# EAGLE design PIC18F2550 (EAGLE 5.11)
LEFT: DCIN; LICENSE: CC-0; PROJECT: PIC18F2550 BB; RIGHT: USB
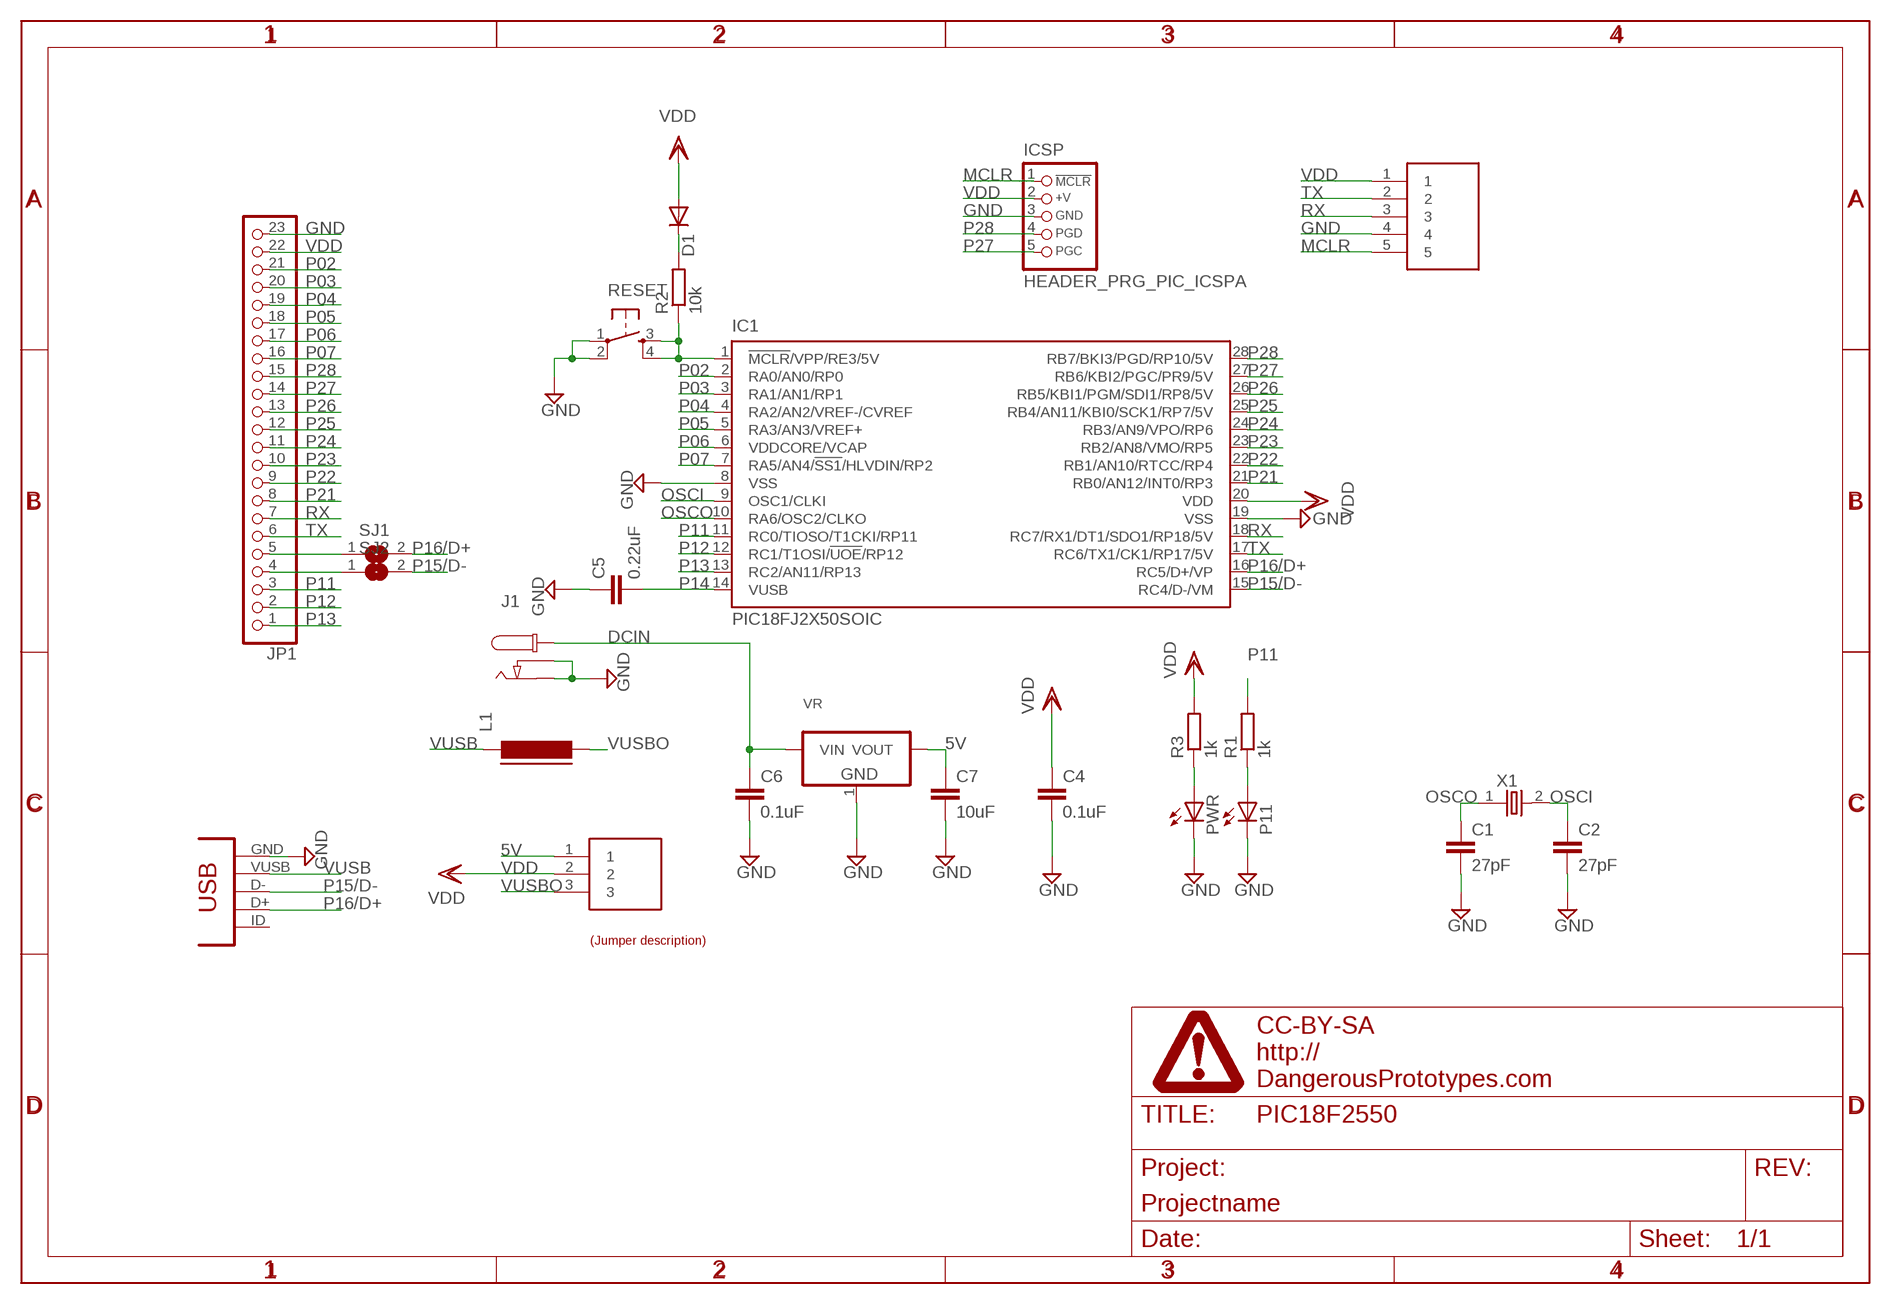
[diagram p0: schematic, sheet 1]

## Parts
C1  27pF  CAPC603  [C603]
C2  27pF  CAPC603  [C603]
C4  0.1uF  CAPC603  [C603]
C5  0.22uF  CAPC603  [C603]
C6  0.1uF  CAPC603  [C603]
C7  10uF  CAPC603  [C603]
D1  DIODEDO323  [DO323]
IC1  PIC18FJ2X50SOIC  [SOIC28W]
ICSP  HEADER_PRG_PIC_ICSPA  [HEADER_PRG_1X05]
J1  DC_BARREL_JACK-SMD  [DC_BARREL_JACK_SMD_2MM]
JP1  PINHD-1X22  [1X22]
L1  FERRITE_BEAD603  [FB603]
P11  LED805  [LED-805]
PWR  LED805  [LED-805]
R1  1k  RESISTORR603  [R603]
R2  10k  RESISTORR603  [R603]
R3  1k  RESISTORR603  [R603]
RESET  SW-SMD-SMALL  [TACT_SWITCH_SMALL]
SJ1  SJ  [SJ]
SJ2  SJ  [SJ]
U$1  DINA4_L  [DP_LOGO]
U$2  HEADER1X3PTH  [M1X3]
U$3  HEADER1X5PTH  [M1X5]
U$4  JUMP3_DESC  [JUMP3_DESC]
USB  CON-USB-MINI-BUSB1  [CONN_USB_MINI-B]
VR  LD1117-3.3SOT223  [SOT223]
X1  OSC-XTAL  [HC-49U]

## Nets
5V: C7.1 U$2.1 VR.2(VOUT)
DCIN: C6.1 J1.P1@2(P1) VR.3(VIN)
GND: C1.2 C2.2 C4.2 C5.1 C6.2 C7.2 IC1.8(VSS) IC1.19(VSS) ICSP.3(GND) J1.P2 J1.P3 JP1.23 P11.C PWR.C RESET.1 RESET.2 U$3.4 USB.GND VR.1(GND)
MCLR: IC1.1(!MCLR!/VPP/RE3/5V) ICSP.1(/MCLR) R2.1 RESET.3 RESET.4 U$3.5
N$1: JP1.4 SJ2.1
N$2: PWR.A R3.1
N$3: JP1.5 SJ1.1
N$4: D1.C R2.2
N$5: P11.A R1.1
OSCI: C2.1 IC1.9(OSC1/CLKI) X1.2
OSCO: C1.1 IC1.10(RA6/OSC2/CLKO) X1.1
P02: IC1.2(RA0/AN0/RP0) JP1.21
P03: IC1.3(RA1/AN1/RP1) JP1.20
P04: IC1.4(RA2/AN2/VREF-/CVREF) JP1.19
P05: IC1.5(RA3/AN3/VREF+) JP1.18
P06: IC1.6(VDDCORE/VCAP) JP1.17
P07: IC1.7(RA5/AN4/!SS1!/HLVDIN/RP2) JP1.16
P11: IC1.11(RC0/TIOSO/T1CKI/RP11) JP1.3 R1.2
P12: IC1.12(RC1/T1OSI/!UOE!/RP12) JP1.2
P13: IC1.13(RC2/AN11/RP13) JP1.1
P14: C5.2 IC1.14(VUSB)
P15/D-: IC1.15(RC4/D-/VM) SJ2.2 USB.D-
P16/D+: IC1.16(RC5/D+/VP) SJ1.2 USB.D+
P21: IC1.21(RB0/AN12/INT0/RP3) JP1.8
P22: IC1.22(RB1/AN10/RTCC/RP4) JP1.9
P23: IC1.23(RB2/AN8/VMO/RP5) JP1.10
P24: IC1.24(RB3/AN9/VPO/RP6) JP1.11
P25: IC1.25(RB4/AN11/KBI0/SCK1/RP7/5V) JP1.12
P26: IC1.26(RB5/KBI1/PGM/SDI1/RP8/5V) JP1.13
P27: IC1.27(RB6/KBI2/PGC/PR9/5V) ICSP.5(PGC) JP1.14
P28: IC1.28(RB7/BKI3/PGD/RP10/5V) ICSP.4(PGD) JP1.15
RX: IC1.18(RC7/RX1/DT1/SDO1/RP18/5V) JP1.7 U$3.3
TX: IC1.17(RC6/TX1/CK1/RP17/5V) JP1.6 U$3.2
VDD: C4.1 D1.A IC1.20(VDD) ICSP.2(+V) JP1.22 R3.2 U$2.2 U$3.1
VUSB: L1.1 USB.VUSB
VUSBO: L1.2 U$2.3
Unconnected: USB.BODY@1(BODY) USB.BODY@2(BODY) USB.BODY@3(BODY) USB.BODY@4(BODY) USB.ID(USBID)

## Library data of the parts
C1 C2 C4-C7 = dp_devices:CAP
D1 = dp_devices:DIODE
IC1 = dp_devices:PIC18FJ2X50
ICSP = dp_devices:HEADER_PRG_PIC_ICSP: 5-pin PIC In Circuit Serial Programming header
J1 = dp_devices:DC_BARREL_JACK: DC power connector
JP1 = pinhead:PINHD-1X22: PIN HEADER
L1 = dp_devices:FERRITE_BEAD
P11 PWR = dp_devices:LED
R1-R3 = dp_devices:RESISTOR
RESET = dp_devices:SW-SMD-SMALL
SJ1 SJ2 = jumper:SJ: SMD solder JUMPER
U$1 = dp_devices:DINA4_L: A4 DP frame Standard Dangerous Prototypes schematic frame. Automagically adds the DP logo and standard texts to the PCB Use the atrribute in the schematic editor to change the fields.; FF1: fulfillment by; FF2: Seeed Studio; FF3: www.seeedstudio.com; LICENSE: CC-BY-SA; PROJECT: Projectname; URL1: http://; URL2: DangerousPrototypes.com
U$2 = dp_devices:HEADER1X3
U$3 = dp_devices:HEADER1X5
U$4 = dp_devices:JUMP3_DESC: Nice formatted three legged jumperdescription Use attributes to change the values LEFT = With jumper to the left RIGHT = With jumper to the right; LEFT: left; RIGHT: right
USB = dp_devices:CON-USB-MINI-B: USB connector
VR = dp_devices:LD1117-3.3
X1 = dp_devices:OSC-XTAL

## Board
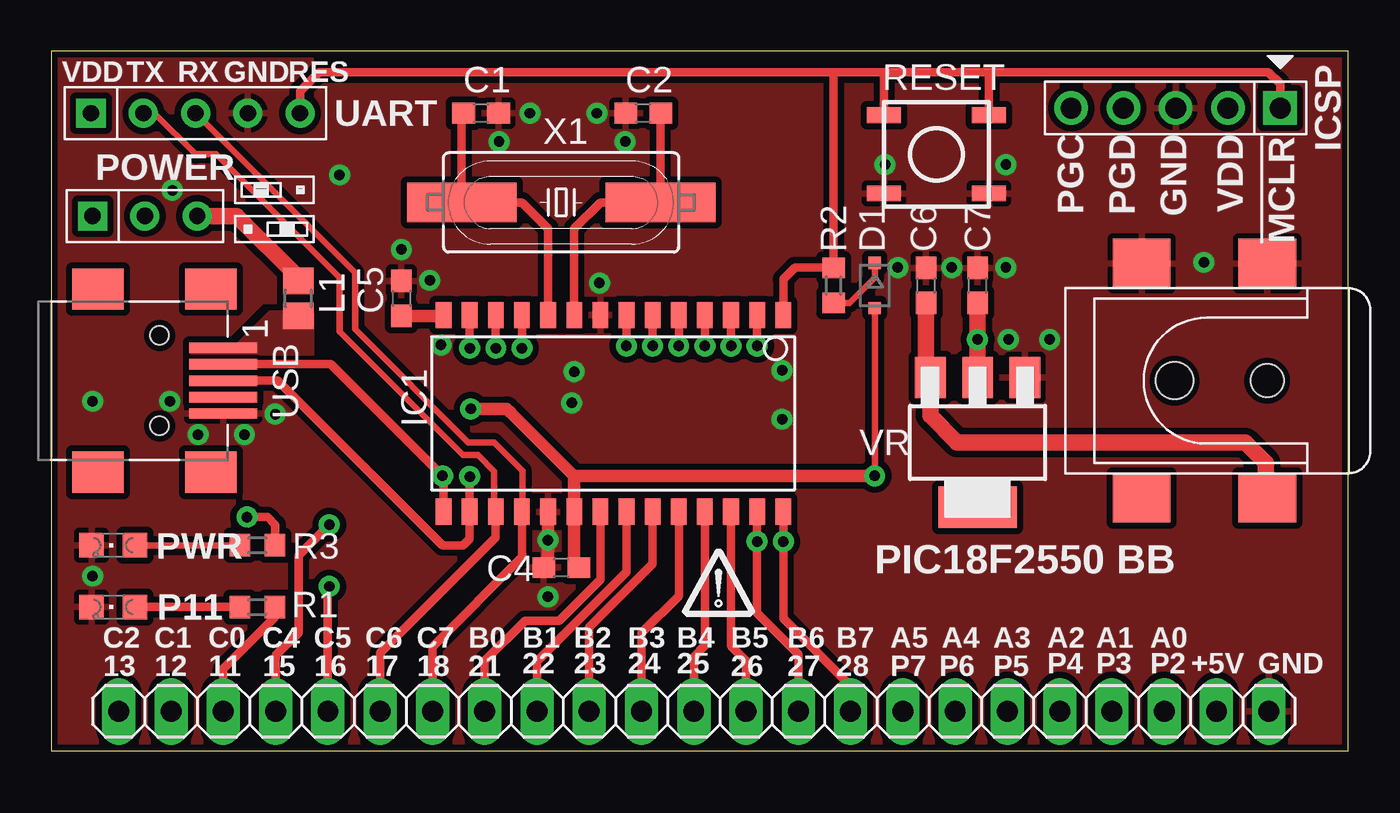
[diagram p1: board, top side]
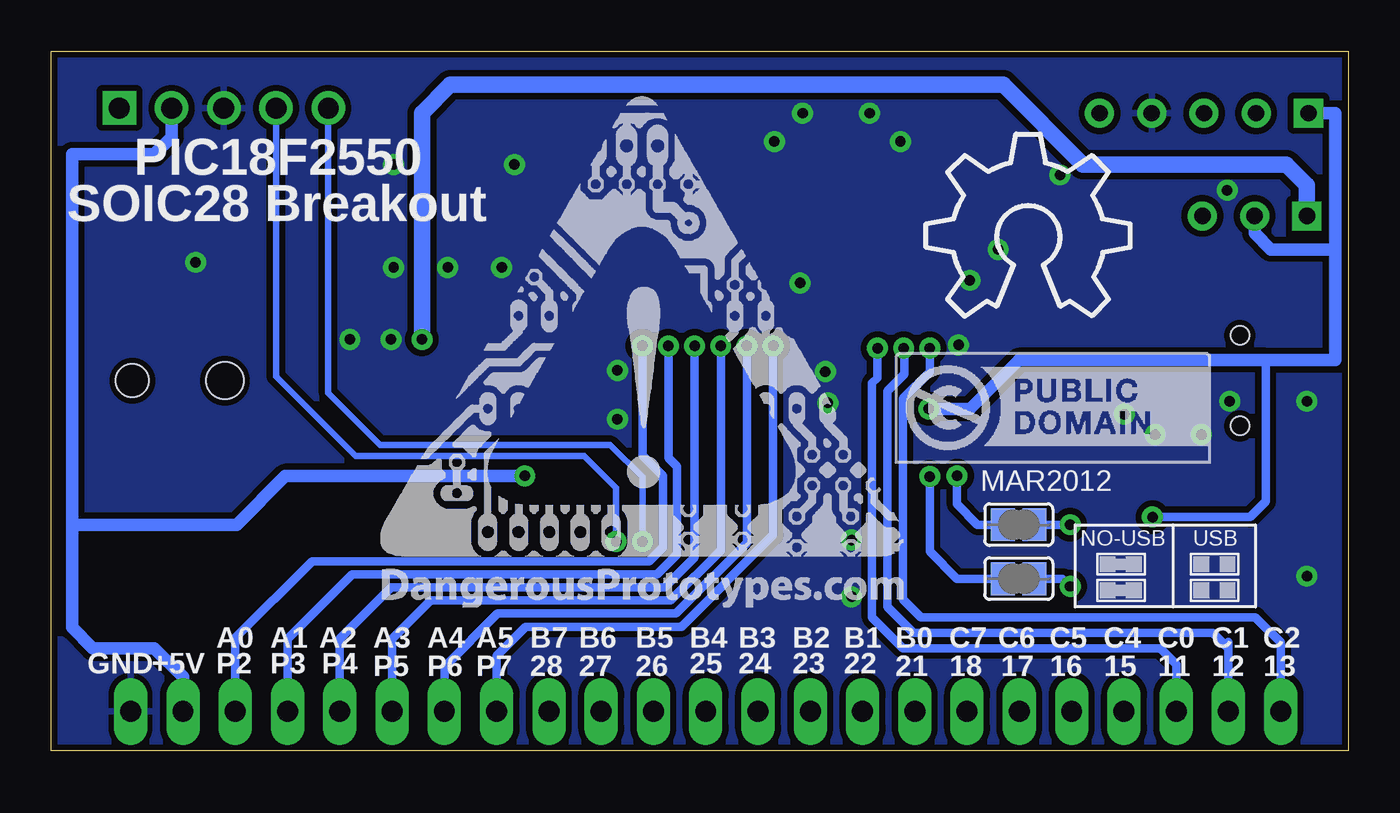
[diagram p2: board, bottom side, seen from below]

Size 63 x 34 mm. Coordinates in mm from the lower left corner, seen from the top.
Outline: 0,0 63,0 63,34 0,34 0,0
Copper layers (1*16): Top 0.035mm / dielectric 1.5mm / Bottom 0.035mm
Design rules "SparkFun": minimum track width 8mil, minimum drill 20mil, track to track 8mil, track to pad 8mil, pad to pad 8mil, via to via 8mil, smd to smd 8mil, copper to edge 10mil, drill to drill 8mil, minimum pad ring 12mil, minimum via ring 10mil, stop-mask expansion 4mil, vias tented up to drill 25mil, thermal gap 10mil

### Footprints (pad centres in the part's own frame; a part is rotated, then mirrored left to right if it is on the bottom)
C603 = smd 1.1 x 1: 1 -0.85,0; 2 0.85,0
DO323 = smd 0.6 x 0.6: A 1.1,0; C -1.1,0
SOIC28W = smd 0.762 x 1.27: 1 -8.89,-4.78; 2 -7.62,-4.78; 3 -6.35,-4.78; 4 -5.08,-4.78; 5 -3.81,-4.78; 6 -2.54,-4.78; 7 -1.27,-4.78; 8 0,-4.78; 9 1.27,-4.78; 10 2.54,-4.78; 11 3.81,-4.78; 12 5.08,-4.78; 13 6.35,-4.78; 14 7.62,-4.78; 15 7.62,4.78; 16 6.35,4.78; 17 5.08,4.78; 18 3.81,4.78; 19 2.54,4.78; 20 1.27,4.78; 21 0,4.78; 22 -1.27,4.78; 23 -2.54,4.78; 24 -3.81,4.78; 25 -5.08,4.78; 26 -6.35,4.78; 27 -7.62,4.78; 28 -8.89,4.78
HEADER_PRG_1X05 = drill 1.016 square: 1 -5.08,0 | drill 1.016 round: 2 -2.54,0; 3 0,0; 4 2.54,0; 5 5.08,0
DC_BARREL_JACK_SMD_2MM = smd 2.4 x 2.8: P1@1 -5.7,3.875; P1@2 -5.7,-2.225; P2 5.7,-2.225; P3 5.7,3.875 | hole 1.8: 0,2.275 | hole 1.6: 0,-2.225
1X22 = drill 1.016 long: 1 -26.67,0; 2 -24.13,0; 3 -21.59,0; 4 -19.05,0; 5 -16.51,0; 6 -13.97,0; 7 -11.43,0; 8 -8.89,0; 9 -6.35,0; 10 -3.81,0; 11 -1.27,0; 12 1.27,0; 13 3.81,0; 14 6.35,0; 15 8.89,0; 16 11.43,0; 17 13.97,0; 18 16.51,0; 19 19.05,0; 20 21.59,0; 21 24.13,0; 22 26.67,0; 23 29.21,0
FB603 = smd 1.3 x 1.5: 1 -0.85,0; 2 0.85,0
LED-805 = smd 1.2 x 1.2: A 0,-1.05; C 0,1.05
R603 = smd 1 x 1.1: 1 -0.85,0; 2 0.85,0
TACT_SWITCH_SMALL = smd 1.651 x 0.762: 1 -2.54,1.905; 2 2.54,1.905; 3 -2.54,-1.905; 4 2.54,-1.905
SJ = smd 1.168 x 1.6: 1 -0.762,0; 2 0.762,0
M1X3 = drill 0.8 square: 1 0,0 | drill 0.8 round: 2 2.54,0; 3 5.08,0
M1X5 = drill 0.8 square: 1 -5.08,0 | drill 0.8 round: 2 -2.54,0; 3 0,0; 4 2.54,0; 5 5.08,0
CONN_USB_MINI-B = smd 2 x 2.5: BODY@1 -4.45,2.5; BODY@2 4.45,2.5; BODY@3 4.45,-3; BODY@4 -4.45,-3 | smd 0.5 x 3.3: D+ 0,3.1; D- -0.8,3.1; GND 1.6,3.1; ID 0.8,3.1; VUSB -1.6,3.1 | hole 0.9: -2.2,0; 2.2,0
SOT223 = smd 1.5 x 2: 1 -2.3,-3.15; 2 0,-3.15; 3 2.3,-3.15 | smd 3.8 x 2: 4 0,3.15
HC-49U = smd 5.334 x 1.93: 1 -4.826,0; 2 4.826,0

### Placement (x,y rotation side)
C1  [C603]  20.88,31 0 top
C2  [C603]  28.75,31 180 top
C4  [C603]  24.77,8.92 180 top
C5  [C603]  17,22 270 top
C6  [C603]  42.5,22.62 90 top
C7  [C603]  45,22.62 90 top
D1  40,22.62 270 top
IC1  26.67,16.41 180 top
ICSP  54.62,31.25 180 top
J1  56.85,18 90 top
JP1  29.94,1.93 0 top
L1  12,22 90 top
P11  3,7 90 top
PWR  3,10 90 top
R1  [R603]  10,7 0 top
R2  [R603]  38,22.62 270 top
R3  [R603]  10,10 0 top
RESET  43,29 180 top
SJ1  16,8.38 180 bottom
SJ2  16,11 180 bottom
U$1  32.41,7.17 0 top
U$2  2,26 0 top
U$3  7,31 0 top
U$4  14,26 0 top
U$5  [DP_LOGO_ART_1X1]  47,7 0 bottom
U$6  [LOGO_CC-0]  22,14 0 bottom
U$7  [OSHW_10X350_NOTEXT]  20.5,21.12 0 bottom
USB  5.25,18 270 top
VR  45,15 180 top
X1  24.77,26.66 0 top

### Tracks (layer width: path | path; a pad name or v marks a point on that pad's centre or on a via)
5V  (via drill 0.51)
  Top 0.813: VR.2 v45,20 C7.1
  Bottom 0.813: v45,20 45,31 43.62,32.38 16.75,32.38 12.88,28.5 3,28.5 2,27.5 U$2.1
DCIN
  Top 0.813: C6.1 42.5,18.35 VR.3 42.7,16.3 44,15 58,15 59,14 59,12.37 J1.P1@2
GND  (via drill 0.51)
  Top 0.61: IC1.19 24.13,9.51 C4.2
  other vias: 2,8.5 5.75,17 7.12,15.38 9.38,15.38 25.27,16.92 24.12,7.5 35.5,16.12 25.4,18.44 18.92,19.74 17,24.38 40.5,28.5 27.88,29.62 23.25,31 26.5,31 56,23.75 48.5,20 43.75,23.5 41.12,23.5 46.38,23.5 24.12,10.25 18.38,22.88 14,28 5.88,27.25 46.38,28.5 46.5,20 21.75,29.62 26.62,22.75 10.88,16.38 35.5,18.5 2,17
  pour Top (isolate 0.305, rank 6): 0,0 63,0 63,34 0,34
  pour Bottom (isolate 0.305, rank 6): 0,0 63,0 63,34 0,34
MCLR
  Top 0.305: IC1.1 35.56,21.07 35.62,21
  Top 0.406: U$3.5 12.08,32.08 13,33 38,33 | 38,33 40.46,33 | 45.54,33 59.12,33 59.7,32.42 ICSP.1 | 38,33 R2.1 37.98,23.5 36.12,23.5 35.56,22.93 IC1.1 | 45.54,33 RESET.3 | 40.46,33 RESET.4 | 40.46,33 45.54,33
N$1  (via drill 0.51)
  Top 0.406: JP1.4 10.89,4.64 12,5.75 12,9.5 v13.5,11
  Bottom 0.406: v13.5,11 SJ2.1
N$2
  Top 0.305: PWR.A R3.1
N$3  (via drill 0.51)
  Top 0.406: JP1.5 13.43,7.93 v13.5,8
  Bottom 0.406: SJ1.1 13.88,8.38 v13.5,8
N$4
  Top 0.305: R2.2 38.77,21.77 40,23 D1.C
N$5
  Top 0.406: P11.A R1.1
OSCI
  Top 0.406: IC1.9 25.4,25.39 26.67,26.66 X1.2 C2.1
OSCO
  Top 0.406: IC1.10 24.13,25.39 22.86,26.66 X1.1 19.94,30.91 C1.1
P02  (via drill 0.51)
  Top 0.406: v34.29,19.68 IC1.2
  Bottom 0.406: v34.29,19.68 34.29,14.37 33.28,13.36 33.28,9.9 33.96,9.22 50.35,9.22 54.07,5.5 JP1.21
P03  (via drill 0.51)
  Top 0.406: v33.02,19.68 IC1.3
  Bottom 0.406: v33.02,19.68 33.02,14.24 32.62,13.84 32.62,9.55 33.58,8.59 48.39,8.59 51.53,5.45 JP1.20
P04  (via drill 0.51)
  Top 0.406: v31.75,19.68 IC1.4
  Bottom 0.406: v31.75,19.68 31.75,9.4 33.2,7.95 46.48,7.95 48.99,5.45 JP1.19
P05  (via drill 0.51)
  Top 0.406: v30.48,19.68 IC1.5
  Bottom 0.406: v30.48,19.68 30.48,9.76 32.92,7.32 44.58,7.32 46.45,5.45 JP1.18
P06  (via drill 0.51)
  Top 0.406: v29.21,19.68 IC1.6
  Bottom 0.406: v29.21,19.68 29.21,10.11 32.64,6.68 41.32,6.68 43.91,4.09 JP1.17
P07  (via drill 0.51)
  Top 0.406: v27.94,19.68 IC1.7
  Bottom 0.406: v27.94,19.68 27.94,10.49 32.39,6.04 39.95,6.04 41.37,4.63 JP1.16
P11  (via drill 0.51)
  Top 0.406: v22.86,19.58 IC1.11 | JP1.3 8.35,4 10.85,6.5 R1.2
  Bottom 0.406: JP1.3 8.35,4.22 9.13,5 21.62,5 23.12,6.5 23.12,17.88 22.86,18.14 v22.86,19.58
P12  (via drill 0.51)
  Top 0.406: v21.59,19.58 IC1.12
  Bottom 0.406: v21.59,19.58 21.57,19.56 21.57,18.31 22.38,17.5 22.38,7 21.12,5.75 6.56,5.75 5.81,5 | JP1.2 5.81,5 | 5.81,5 5.81,5.31
P13  (via drill 0.51)
  Top 0.406: v20.32,19.58 IC1.13
  Bottom 0.406: v20.32,19.58 20.32,18.43 21.62,17.12 21.62,7.38 20.75,6.5 4.5,6.5 3.27,5.27 JP1.1
P14
  Top 0.61: C5.2 19.01,21.15 IC1.14
P15/D-  (via drill 0.51)
  Top 0.406: 19.05,11.96 IC1.15 19.05,13.32 v19,13.38 13.57,18.8 USB.D-
  Bottom 0.406: v19,13.38 19,12 18,11 SJ2.2
P16/D+  (via drill 0.51)
  Top 0.406: v20.32,13.34 IC1.16 20.32,10.32 20,10 19,10 11,18 USB.D+
  Bottom 0.406: v20.32,13.34 20.32,9.7 19,8.38 SJ1.2
P21
  Top 0.406: IC1.21 26.67,8.33 24.66,6.33 23,6.33 21.05,4.38 JP1.8
P22
  Top 0.406: IC1.22 27.94,8.71 23.59,4.36 JP1.9
P23
  Top 0.406: IC1.23 29.21,9.09 26.13,6.01 JP1.10
P24
  Top 0.406: IC1.24 30.48,7.54 28.67,5.73 JP1.11
P25
  Top 0.406: IC1.25 31.75,5.12 31.21,4.58 JP1.12
P26
  Top 0.406: IC1.26 33.02,5.11 33.75,4.38 JP1.13
P27  (via drill 0.51)
  Top 0.406: IC1.27 v34.29,10.18 34.29,6.71 36.29,4.71 JP1.14
  Bottom 0.305: v34.29,10.18 34.29,13.31 35.86,14.88 47.03,14.88 49.55,17.4 ICSP.5
P28  (via drill 0.51)
  Top 0.406: IC1.28 v35.56,10.18 35.56,6.44 38.83,3.17 JP1.15
  Bottom 0.305: v35.56,10.18 35.56,12.78 37.12,14.35 48.23,14.35 52.09,18.2 ICSP.4
RX
  Top 0.305: IC1.18 22.89,11.65 22.89,13.61 21.5,15 20.25,15 14.75,20.5 14.75,23.25 U$3.3
  Top 0.406: IC1.18 22.86,9.42 18.51,5.07 JP1.7
TX
  Top 0.305: IC1.17 21.51,11.71 21.51,13.59 20.73,14.38 20,14.38 14,20.38 14,23 8,29 7,29 5,31 U$3.2
  Top 0.406: IC1.17 21.59,10.39 15.97,4.77 JP1.6
VDD  (via drill 0.51)
  Top 0.305: v40,13.38 D1.A
  Top 0.406: v9.5,11.38 10.5,11.38 10.88,11 10.88,10.03 R3.2
  Top 0.61: 25.4,13.36 IC1.20 25.4,9.26 C4.1 | 25.4,13.36 v40,13.38 | 25.4,13.36 22.31,16.45 22.3,16.45 22.12,16.62 v20.38,16.62
  Bottom 0.406: v9.5,11.38 4.75,11.38 4,12.12 4,19
  Bottom 0.61: v40,13.38 43.77,13.36 51.64,13.36 54,11 62,11 | 62,11 62,6 61,5 58,5 56.61,3.61 JP1.22 | 62,11 62,29 58,29 57.16,29.84 ICSP.2 | v20.38,16.62 18.38,16.62 16,19 4,19 0.62,19 0.62,24.38 | 0.62,24.38 0.62,31 U$3.1 | U$2.2 4.54,25.16 3.75,24.38 0.62,24.38
VUSB
  pour Top (no thermals): 6.88,18.38 6.88,19.62 9,19.62 10.62,21.25 12.62,21.25 12.62,18.5 12.5,18.38
VUSBO
  Top 0.813: L1.2 12,23 9,26 U$2.3

### Text on the board
tNames: VDD | TX | RX | GND | RES | UART | PGC | PGD | GND | VDD | !MCLR | POWER | PIC18F2550 BB | C2 | C1 | C0 | C4 | C5 | C6 | C7 | B0 | B1 | B2 | B3 | B4 | B5 | B6 | B7 | A5 | A4 | A3 | A2 | A1 | A0 | 13 | 12 | 11 | 15 | 16 | 17 | 18 | 21 | 22 | 23 | 24 | 25 | 26 | 27 | 28 | P7 | P6 | P5 | P4 | P3 | P2 | +5V | GND
bNames: PIC18F2550 | SOIC28 Breakout | MAR2012 | USB | NO-USB | C2 | C1 | C0 | C4 | C5 | C6 | C7 | B0 | B1 | B2 | B3 | B4 | B5 | B6 | B7 | A5 | A4 | A3 | A2 | A1 | A0 | 13 | 12 | 11 | 15 | 16 | 17 | 18 | 21 | 22 | 23 | 24 | 25 | 26 | 27 | 28 | P7 | P6 | P5 | P4 | P3 | P2 | +5V | GND